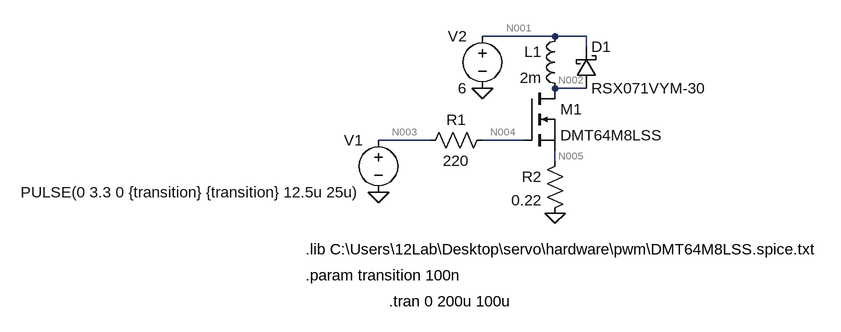
[diagram p0: schematic pwm.asc]
pwm.asc, the LTspice schematic file:
Version 4.1
SHEET 1 1040 680
WIRE 480 -320 368 -320
WIRE 528 -320 480 -320
WIRE 528 -304 528 -320
WIRE 528 -240 480 -240
WIRE 288 -160 208 -160
WIRE 432 -160 368 -160
WIRE 480 -128 480 -144
FLAG 480 -48 0
FLAG 208 -80 0
FLAG 368 -240 0
SYMBOL nmos 432 -240 R0
SYMATTR InstName M1
SYMATTR Value DMT64M8LSS
SYMATTR Prefix x
SYMBOL voltage 208 -176 M0
WINDOW 123 0 0 Left 0
SYMATTR InstName V1
SYMATTR Value PULSE(0 3.3 0 {transition} {transition} 12.5u 25u)
SYMBOL voltage 368 -336 M0
WINDOW 123 0 0 Left 0
WINDOW 39 0 0 Left 0
SYMATTR InstName V2
SYMATTR Value 6
SYMBOL res 496 -144 M0
SYMATTR InstName R2
SYMATTR Value 0.22
SYMBOL ind 496 -336 M0
SYMATTR InstName L1
SYMATTR Value 2m
SYMATTR SpiceLine Rser=46 Cpar=100n
SYMBOL schottky 512 -240 M180
WINDOW 0 24 64 Left 2
WINDOW 3 24 0 Left 2
SYMATTR InstName D1
SYMATTR Value RSX071VYM-30
SYMATTR Description Diode
SYMATTR Type diode
SYMBOL res 384 -176 R90
WINDOW 0 0 56 VBottom 2
WINDOW 3 32 56 VTop 2
SYMATTR InstName R1
SYMATTR Value 220
TEXT 96 8 Left 2 !.lib C:\\Users\\12Lab\\Desktop\\servo\\hardware\\pwm\\DMT64M8LSS.spice.txt
TEXT 224 88 Left 2 !.tran 0 200u 100u
TEXT 96 48 Left 2 !.param transition 100n

The netlist it stands for:
* pwm.asc
X§M1 N002 N004 N005 DMT64M8LSS  ; pins D G S
V1 N003 0 PULSE(0 3.3 0 {transition} {transition} 12.5u 25u)
V2 N001 0 6
R2 N005 0 0.22
L1 N001 N002 2m Rser=46 Cpar=100n
D1 N002 N001 RSX071VYM-30
R1 N004 N003 220
.model D D
.lib standard.dio
.lib C:\Users\12Lab\Desktop\servo\hardware\pwm\DMT64M8LSS.spice.txt
.tran 0 200u 100u
.param transition 100n
.backanno
.end

* Results of the author's LTspice run, read from the files saved beside the schematic
* Operating Point, zero values left out:
*   V(n001) = 6 V
*   V(n002) = 6 V
*   I(D1) = -87.65 pA
*   I(L1) = 7.436 nA
*   I(R1) = 6.01 pA
*   I(R2) = 7.518 nA
*   I(V1) = 6.01 pA
*   I(V2) = -7.524 nA
*   Ix(m1:10) = 7.524 nA
*   Ix(m1:20) = -6.01 pA
*   Ix(m1:30) = -7.518 nA
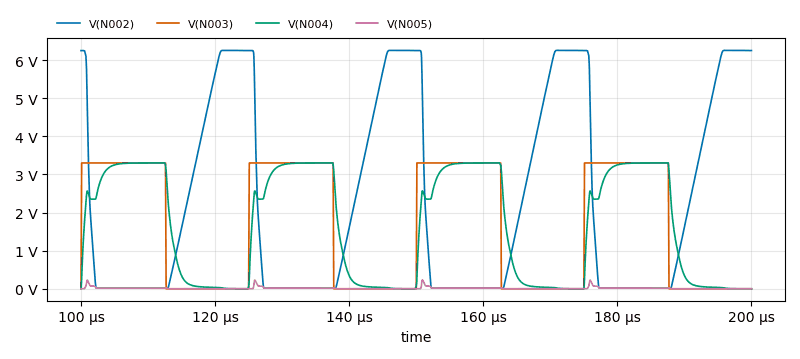
[diagram p1: Transient Analysis of pwm.asc, plotted from the saved traces]
* Transient Analysis, 1 run:
*   V(N002): min 16.45 mV, max 6.254 V, average 2.367 V, rms 3.522 V, last 6.25 V
*   V(N003): min 0 V, max 3.3 V, average 1.663 V, rms 2.342 V, last 0 V
*   V(N004): min -16.52 µV, max 3.3 V, average 1.663 V, rms 2.224 V, last -16.52 µV
*   V(N005): min -738.1 µV, max 231.2 mV, average 13.88 mV, rms 31.71 mV, last -256.3 nV